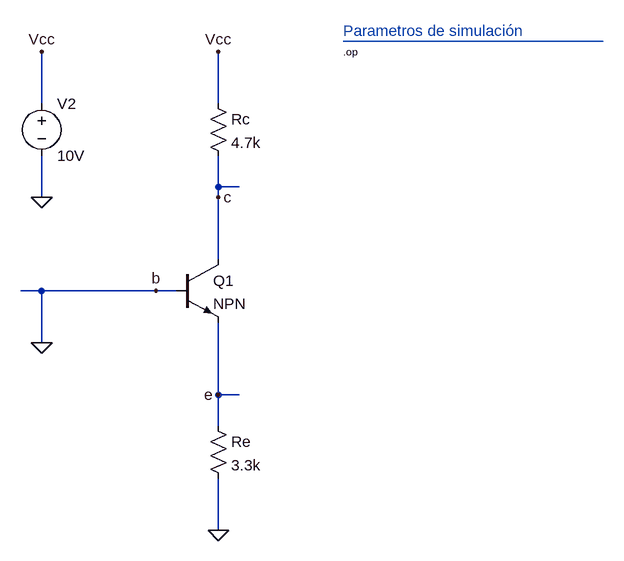
[diagram p0: schematic ejemplo_5-8.asc]
ejemplo_5-8.asc, the LTspice schematic file:
Version 4
SHEET 1 1376 680
WIRE -304 -240 -304 -320
WIRE -32 -240 -32 -320
WIRE -32 -112 -32 -160
WIRE 0 -112 -32 -112
WIRE -304 -96 -304 -160
WIRE -32 -96 -32 -112
WIRE -32 0 -32 -96
WIRE -304 48 -336 48
WIRE -128 48 -304 48
WIRE -96 48 -128 48
WIRE -304 128 -304 48
WIRE -32 208 -32 96
WIRE 0 208 -32 208
WIRE -32 256 -32 208
WIRE -32 416 -32 336
FLAG -32 416 0
FLAG -304 -96 0
FLAG -32 -96 c
FLAG -32 208 e
FLAG -128 48 b
FLAG -304 -320 Vcc
FLAG -32 -320 Vcc
FLAG -304 128 0
DATAFLAG -336 48 ""
DATAFLAG 0 208 ""
DATAFLAG 0 -112 ""
DATAFLAG -192 80 "Ib(Q1)"
DATAFLAG 16 144 "I(Re)"
DATAFLAG 48 -32 "Ic(Q1)"
SYMBOL res -48 -256 R0
SYMATTR InstName Rc
SYMATTR Value 4.7k
SYMBOL npn -96 0 R0
SYMATTR InstName Q1
SYMBOL res -48 240 R0
SYMATTR InstName Re
SYMATTR Value 3.3k
SYMBOL voltage -304 -256 R0
WINDOW 123 0 0 Left 0
WINDOW 39 0 0 Left 0
SYMATTR InstName V2
SYMATTR Value 10V
TEXT 160 -352 Left 2 ;Parametros de simulación
TEXT 160 -320 Left 1 !.op
LINE Normal 560 -336 160 -336
LINE Normal 560 -336 560 -336 2
LINE Normal 560 -336 560 -336 2

The netlist it stands for:
* ejemplo_5-8.asc
Rc Vcc c 4.7k
Q1 c 0 e 0 NPN
Re e 0 3.3k
V2 Vcc 0 10V
.model NPN NPN
.model PNP PNP
.lib standard.bjt
* Parametros de simulación
.op
.backanno
.end